# Altium project T0017_HPC_UFL_DEBUG_BOARD.PrjPcb (part 2 of 2)
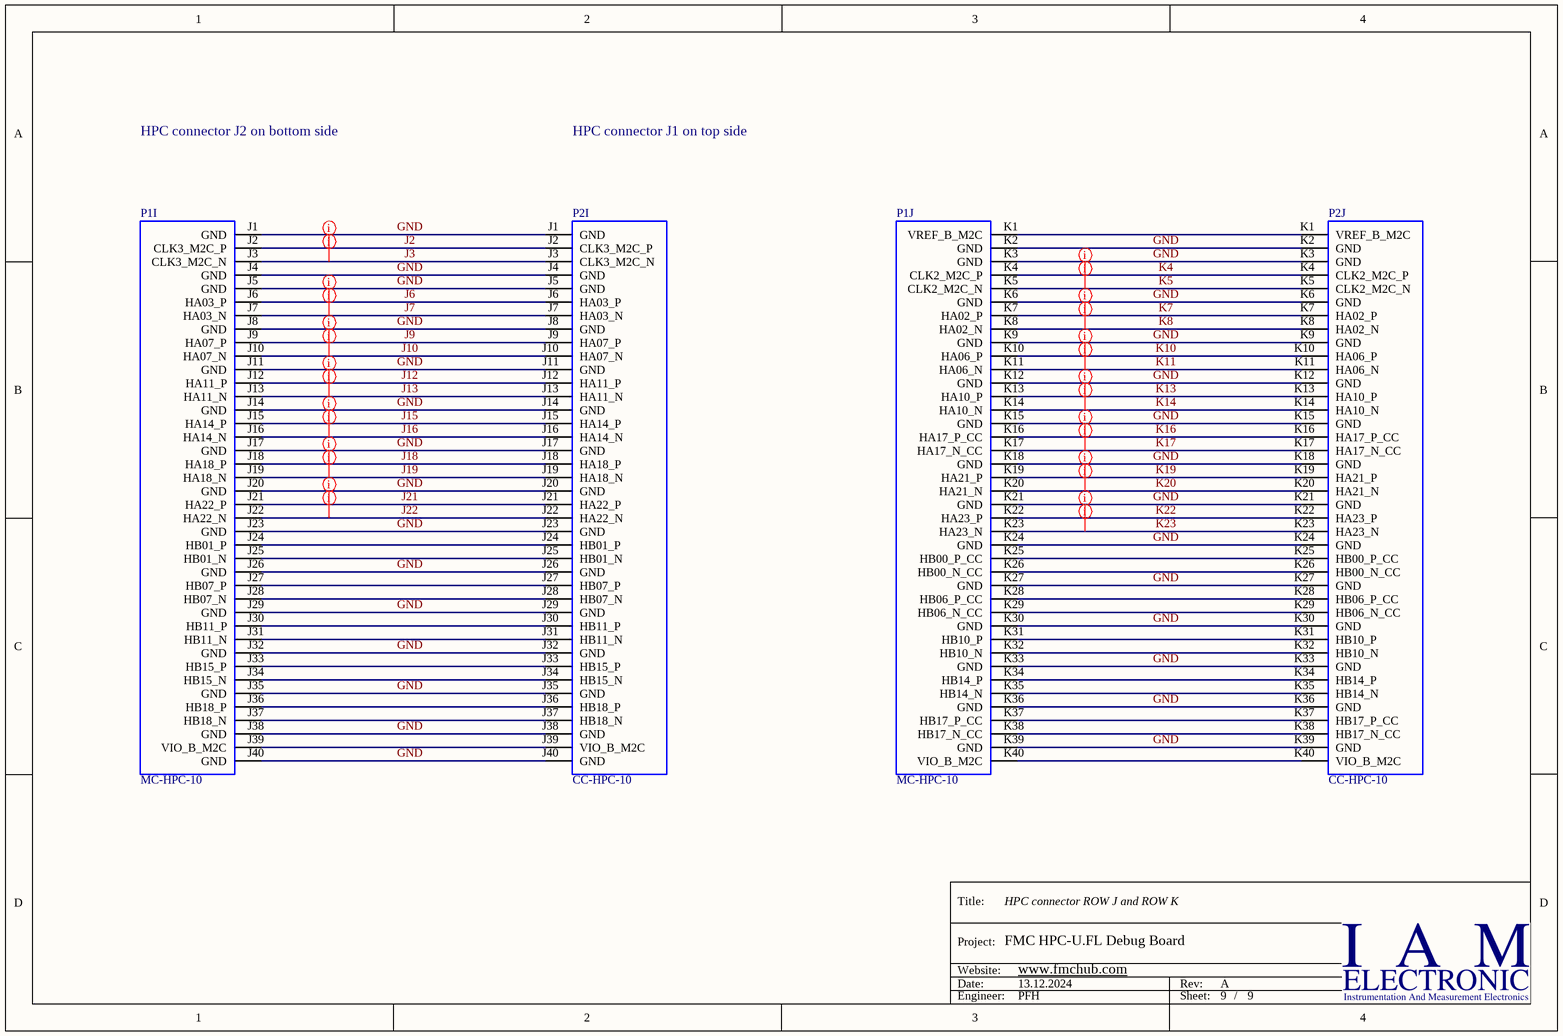
[diagram p9: FMC_HPC_UFL_DEBUG_HPC_JK.SchDoc]

## Nets that join several sheets
GND: FMC_HPC_UFL_DEBUG_TOP (MH1.0 MH2.0), FMC_HPC_UFL_DEBUG_J1_J84 (168 pins), FMC_HPC_UFL_DEBUG_J85_J156 (144 pins), FMC_HPC_UFL_DEBUG_TP_SMA (48 pins), FMC_HPC_UFL_DEBUG_HPC_AB (80 pins), FMC_HPC_UFL_DEBUG_HPC_CD (68 pins), FMC_HPC_UFL_DEBUG_HPC_EF (59 pins), FMC_HPC_UFL_DEBUG_HPC_GH (56 pins), FMC_HPC_UFL_DEBUG_HPC_JK (58 pins)
3P3V: FMC_HPC_UFL_DEBUG_HPC_CD (9 pins), FMC_HPC_UFL_DEBUG_HPC_EF (TP2.1)
3P3VAUX: FMC_HPC_UFL_DEBUG_HPC_CD (P1.D32 P2.D32), FMC_HPC_UFL_DEBUG_HPC_EF (TP3.1)
12P0V: FMC_HPC_UFL_DEBUG_HPC_CD (P1.C35 P1.C37 P2.C35 P2.C37), FMC_HPC_UFL_DEBUG_HPC_EF (TP4.1)
C10: FMC_HPC_UFL_DEBUG_J1_J84 (J43.3), FMC_HPC_UFL_DEBUG_HPC_CD (P1.C10 P2.C10)
C11: FMC_HPC_UFL_DEBUG_J1_J84 (J55.3), FMC_HPC_UFL_DEBUG_HPC_CD (P1.C11 P2.C11)
C14: FMC_HPC_UFL_DEBUG_J1_J84 (J73.3), FMC_HPC_UFL_DEBUG_HPC_CD (P1.C14 P2.C14)
C15: FMC_HPC_UFL_DEBUG_J1_J84 (J61.3), FMC_HPC_UFL_DEBUG_HPC_CD (P1.C15 P2.C15)
C18: FMC_HPC_UFL_DEBUG_J1_J84 (J74.3), FMC_HPC_UFL_DEBUG_HPC_CD (P1.C18 P2.C18)
C19: FMC_HPC_UFL_DEBUG_J1_J84 (J62.3), FMC_HPC_UFL_DEBUG_HPC_CD (P1.C19 P2.C19)
C22: FMC_HPC_UFL_DEBUG_J1_J84 (J39.3), FMC_HPC_UFL_DEBUG_HPC_CD (P1.C22 P2.C22)
C23: FMC_HPC_UFL_DEBUG_J1_J84 (J51.3), FMC_HPC_UFL_DEBUG_HPC_CD (P1.C23 P2.C23)
C26: FMC_HPC_UFL_DEBUG_J1_J84 (J50.3), FMC_HPC_UFL_DEBUG_HPC_CD (P1.C26 P2.C26)
C27: FMC_HPC_UFL_DEBUG_J1_J84 (J38.3), FMC_HPC_UFL_DEBUG_HPC_CD (P1.C27 P2.C27)
CK0_M2C_N: FMC_HPC_UFL_DEBUG_J1_J84 (J23.3), FMC_HPC_UFL_DEBUG_HPC_CD (P1.D5 P2.D5)
CK0_M2C_P: FMC_HPC_UFL_DEBUG_J1_J84 (J35.3), FMC_HPC_UFL_DEBUG_HPC_CD (P1.D4 P2.D4)
CK1_M2C_N: FMC_HPC_UFL_DEBUG_J1_J84 (J72.3), FMC_HPC_UFL_DEBUG_HPC_AB (P1.B21 P2.B21)
CK1_M2C_P: FMC_HPC_UFL_DEBUG_J1_J84 (J71.3), FMC_HPC_UFL_DEBUG_HPC_AB (P1.B20 P2.B20)
D8: FMC_HPC_UFL_DEBUG_J1_J84 (J19.3), FMC_HPC_UFL_DEBUG_HPC_CD (P1.D8 P2.D8)
D9: FMC_HPC_UFL_DEBUG_J1_J84 (J31.3), FMC_HPC_UFL_DEBUG_HPC_CD (P1.D9 P2.D9)
D11: FMC_HPC_UFL_DEBUG_J1_J84 (J67.3), FMC_HPC_UFL_DEBUG_HPC_CD (P1.D11 P2.D11)
D12: FMC_HPC_UFL_DEBUG_J1_J84 (J79.3), FMC_HPC_UFL_DEBUG_HPC_CD (P1.D12 P2.D12)
D14: FMC_HPC_UFL_DEBUG_J1_J84 (J49.3), FMC_HPC_UFL_DEBUG_HPC_CD (P1.D14 P2.D14)
D15: FMC_HPC_UFL_DEBUG_J1_J84 (J37.3), FMC_HPC_UFL_DEBUG_HPC_CD (P1.D15 P2.D15)
D17: FMC_HPC_UFL_DEBUG_J1_J84 (J25.3), FMC_HPC_UFL_DEBUG_HPC_CD (P1.D17 P2.D17)
D18: FMC_HPC_UFL_DEBUG_J1_J84 (J13.3), FMC_HPC_UFL_DEBUG_HPC_CD (P1.D18 P2.D18)
D20: FMC_HPC_UFL_DEBUG_J1_J84 (J15.3), FMC_HPC_UFL_DEBUG_HPC_CD (P1.D20 P2.D20)
D21: FMC_HPC_UFL_DEBUG_J1_J84 (J27.3), FMC_HPC_UFL_DEBUG_HPC_CD (P1.D21 P2.D21)
D23: FMC_HPC_UFL_DEBUG_J1_J84 (J63.3), FMC_HPC_UFL_DEBUG_HPC_CD (P1.D23 P2.D23)
D24: FMC_HPC_UFL_DEBUG_J1_J84 (J75.3), FMC_HPC_UFL_DEBUG_HPC_CD (P1.D24 P2.D24)
D26: FMC_HPC_UFL_DEBUG_J1_J84 (J14.3), FMC_HPC_UFL_DEBUG_HPC_CD (P1.D26 P2.D26)
D27: FMC_HPC_UFL_DEBUG_J1_J84 (J26.3), FMC_HPC_UFL_DEBUG_HPC_CD (P1.D27 P2.D27)
DP0_C2M_N: FMC_HPC_UFL_DEBUG_J1_J84 (J24.3), FMC_HPC_UFL_DEBUG_HPC_CD (P1.C3 P2.C3)
DP0_C2M_P: FMC_HPC_UFL_DEBUG_J1_J84 (J36.3), FMC_HPC_UFL_DEBUG_HPC_CD (P1.C2 P2.C2)
DP0_M2C_N: FMC_HPC_UFL_DEBUG_J1_J84 (J34.3), FMC_HPC_UFL_DEBUG_HPC_CD (P1.C7 P2.C7)
DP0_M2C_P: FMC_HPC_UFL_DEBUG_J1_J84 (J22.3), FMC_HPC_UFL_DEBUG_HPC_CD (P1.C6 P2.C6)
DP1_C2M_N: FMC_HPC_UFL_DEBUG_J1_J84 (J84.3), FMC_HPC_UFL_DEBUG_HPC_AB (P1.A23 P2.A23)
DP1_C2M_P: FMC_HPC_UFL_DEBUG_J1_J84 (J83.3), FMC_HPC_UFL_DEBUG_HPC_AB (P1.A22 P2.A22)
DP1_M2C_N: FMC_HPC_UFL_DEBUG_J1_J84 (J70.3), FMC_HPC_UFL_DEBUG_HPC_AB (P1.A3 P2.A3)
DP1_M2C_P: FMC_HPC_UFL_DEBUG_J1_J84 (J69.3), FMC_HPC_UFL_DEBUG_HPC_AB (P1.A2 P2.A2)
DP2_C2M_N: FMC_HPC_UFL_DEBUG_J1_J84 (J2.3), FMC_HPC_UFL_DEBUG_HPC_AB (P1.A27 P2.A27)
DP2_C2M_P: FMC_HPC_UFL_DEBUG_J1_J84 (J1.3), FMC_HPC_UFL_DEBUG_HPC_AB (P1.A26 P2.A26)
DP2_M2C_N: FMC_HPC_UFL_DEBUG_J1_J84 (J82.3), FMC_HPC_UFL_DEBUG_HPC_AB (P1.A7 P2.A7)
DP2_M2C_P: FMC_HPC_UFL_DEBUG_J1_J84 (J81.3), FMC_HPC_UFL_DEBUG_HPC_AB (P1.A6 P2.A6)
DP3_C2M_N: FMC_HPC_UFL_DEBUG_J1_J84 (J4.3), FMC_HPC_UFL_DEBUG_HPC_AB (P1.A31 P2.A31)
DP3_C2M_P: FMC_HPC_UFL_DEBUG_J1_J84 (J3.3), FMC_HPC_UFL_DEBUG_HPC_AB (P1.A30 P2.A30)
DP3_M2C_N: FMC_HPC_UFL_DEBUG_J1_J84 (J46.3), FMC_HPC_UFL_DEBUG_HPC_AB (P1.A11 P2.A11)
DP3_M2C_P: FMC_HPC_UFL_DEBUG_J1_J84 (J45.3), FMC_HPC_UFL_DEBUG_HPC_AB (P1.A10 P2.A10)
DP4_C2M_N: FMC_HPC_UFL_DEBUG_J1_J84 (J6.3), FMC_HPC_UFL_DEBUG_HPC_AB (P1.A35 P2.A35)
DP4_C2M_P: FMC_HPC_UFL_DEBUG_J1_J84 (J5.3), FMC_HPC_UFL_DEBUG_HPC_AB (P1.A34 P2.A34)
DP4_M2C_N: FMC_HPC_UFL_DEBUG_J1_J84 (J58.3), FMC_HPC_UFL_DEBUG_HPC_AB (P1.A15 P2.A15)
DP4_M2C_P: FMC_HPC_UFL_DEBUG_J1_J84 (J57.3), FMC_HPC_UFL_DEBUG_HPC_AB (P1.A14 P2.A14)
DP5_C2M_N: FMC_HPC_UFL_DEBUG_J1_J84 (J10.3), FMC_HPC_UFL_DEBUG_HPC_AB (P1.A39 P2.A39)
DP5_C2M_P: FMC_HPC_UFL_DEBUG_J1_J84 (J9.3), FMC_HPC_UFL_DEBUG_HPC_AB (P1.A38 P2.A38)
DP5_M2C_N: FMC_HPC_UFL_DEBUG_J1_J84 (J60.3), FMC_HPC_UFL_DEBUG_HPC_AB (P1.A19 P2.A19)
DP5_M2C_P: FMC_HPC_UFL_DEBUG_J1_J84 (J59.3), FMC_HPC_UFL_DEBUG_HPC_AB (P1.A18 P2.A18)
DP6_C2M_N: FMC_HPC_UFL_DEBUG_J1_J84 (J8.3), FMC_HPC_UFL_DEBUG_HPC_AB (P1.B37 P2.B37)
DP6_C2M_P: FMC_HPC_UFL_DEBUG_J1_J84 (J7.3), FMC_HPC_UFL_DEBUG_HPC_AB (P1.B36 P2.B36)
DP6_M2C_N: FMC_HPC_UFL_DEBUG_J1_J84 (J48.3), FMC_HPC_UFL_DEBUG_HPC_AB (P1.B17 P2.B17)
DP6_M2C_P: FMC_HPC_UFL_DEBUG_J1_J84 (J47.3), FMC_HPC_UFL_DEBUG_HPC_AB (P1.B16 P2.B16)
E2: FMC_HPC_UFL_DEBUG_J1_J84 (J56.3), FMC_HPC_UFL_DEBUG_HPC_EF (P1.E2 P2.E2)
E3: FMC_HPC_UFL_DEBUG_J1_J84 (J44.3), FMC_HPC_UFL_DEBUG_HPC_EF (P1.E3 P2.E3)
E6: FMC_HPC_UFL_DEBUG_J1_J84 (J33.3), FMC_HPC_UFL_DEBUG_HPC_EF (P1.E6 P2.E6)
E7: FMC_HPC_UFL_DEBUG_J1_J84 (J21.3), FMC_HPC_UFL_DEBUG_HPC_EF (P1.E7 P2.E7)
E9: FMC_HPC_UFL_DEBUG_J1_J84 (J54.3), FMC_HPC_UFL_DEBUG_HPC_EF (P1.E9 P2.E9)
E10: FMC_HPC_UFL_DEBUG_J1_J84 (J42.3), FMC_HPC_UFL_DEBUG_HPC_EF (P1.E10 P2.E10)
E12: FMC_HPC_UFL_DEBUG_J1_J84 (J77.3), FMC_HPC_UFL_DEBUG_HPC_EF (P1.E12 P2.E12)
E13: FMC_HPC_UFL_DEBUG_J1_J84 (J65.3), FMC_HPC_UFL_DEBUG_HPC_EF (P1.E13 P2.E13)
E15: FMC_HPC_UFL_DEBUG_J1_J84 (J29.3), FMC_HPC_UFL_DEBUG_HPC_EF (P1.E15 P2.E15)
E16: FMC_HPC_UFL_DEBUG_J1_J84 (J17.3), FMC_HPC_UFL_DEBUG_HPC_EF (P1.E16 P2.E16)
E18: FMC_HPC_UFL_DEBUG_J1_J84 (J40.3), FMC_HPC_UFL_DEBUG_HPC_EF (P1.E18 P2.E18)
E19: FMC_HPC_UFL_DEBUG_J1_J84 (J52.3), FMC_HPC_UFL_DEBUG_HPC_EF (P1.E19 P2.E19)
F4: FMC_HPC_UFL_DEBUG_J1_J84 (J32.3), FMC_HPC_UFL_DEBUG_HPC_EF (P1.F4 P2.F4)
F5: FMC_HPC_UFL_DEBUG_J1_J84 (J20.3), FMC_HPC_UFL_DEBUG_HPC_EF (P1.F5 P2.F5)
F7: FMC_HPC_UFL_DEBUG_J1_J84 (J78.3), FMC_HPC_UFL_DEBUG_HPC_EF (P1.F7 P2.F7)
F8: FMC_HPC_UFL_DEBUG_J1_J84 (J66.3), FMC_HPC_UFL_DEBUG_HPC_EF (P1.F8 P2.F8)
F10: FMC_HPC_UFL_DEBUG_J1_J84 (J30.3), FMC_HPC_UFL_DEBUG_HPC_EF (P1.F10 P2.F10)
F11: FMC_HPC_UFL_DEBUG_J1_J84 (J18.3), FMC_HPC_UFL_DEBUG_HPC_EF (P1.F11 P2.F11)
F13: FMC_HPC_UFL_DEBUG_J1_J84 (J53.3), FMC_HPC_UFL_DEBUG_HPC_EF (P1.F13 P2.F13)
F14: FMC_HPC_UFL_DEBUG_J1_J84 (J41.3), FMC_HPC_UFL_DEBUG_HPC_EF (P1.F14 P2.F14)
F16: FMC_HPC_UFL_DEBUG_J1_J84 (J28.3), FMC_HPC_UFL_DEBUG_HPC_EF (P1.F16 P2.F16)
F17: FMC_HPC_UFL_DEBUG_J1_J84 (J16.3), FMC_HPC_UFL_DEBUG_HPC_EF (P1.F17 P2.F17)
F19: FMC_HPC_UFL_DEBUG_J1_J84 (J64.3), FMC_HPC_UFL_DEBUG_HPC_EF (P1.F19 P2.F19)
F20: FMC_HPC_UFL_DEBUG_J1_J84 (J76.3), FMC_HPC_UFL_DEBUG_HPC_EF (P1.F20 P2.F20)
G2: FMC_HPC_UFL_DEBUG_J1_J84 (J80.3), FMC_HPC_UFL_DEBUG_HPC_GH (P1.G2 P2.G2)
G3: FMC_HPC_UFL_DEBUG_J1_J84 (J68.3), FMC_HPC_UFL_DEBUG_HPC_GH (P1.G3 P2.G3)
G6: FMC_HPC_UFL_DEBUG_J85_J156 (J95.3), FMC_HPC_UFL_DEBUG_HPC_GH (P1.G6 P2.G6)
G7: FMC_HPC_UFL_DEBUG_J85_J156 (J107.3), FMC_HPC_UFL_DEBUG_HPC_GH (P1.G7 P2.G7)
G9: FMC_HPC_UFL_DEBUG_J85_J156 (J94.3), FMC_HPC_UFL_DEBUG_HPC_GH (P1.G9 P2.G9)
G10: FMC_HPC_UFL_DEBUG_J85_J156 (J106.3), FMC_HPC_UFL_DEBUG_HPC_GH (P1.G10 P2.G10)
G12: FMC_HPC_UFL_DEBUG_J85_J156 (J93.3), FMC_HPC_UFL_DEBUG_HPC_GH (P1.G12 P2.G12)
G13: FMC_HPC_UFL_DEBUG_J85_J156 (J105.3), FMC_HPC_UFL_DEBUG_HPC_GH (P1.G13 P2.G13)
G15: FMC_HPC_UFL_DEBUG_J85_J156 (J92.3), FMC_HPC_UFL_DEBUG_HPC_GH (P1.G15 P2.G15)
G16: FMC_HPC_UFL_DEBUG_J85_J156 (J104.3), FMC_HPC_UFL_DEBUG_HPC_GH (P1.G16 P2.G16)
G18: FMC_HPC_UFL_DEBUG_J85_J156 (J103.3), FMC_HPC_UFL_DEBUG_HPC_GH (P1.G18 P2.G18)
G19: FMC_HPC_UFL_DEBUG_J85_J156 (J91.3), FMC_HPC_UFL_DEBUG_HPC_GH (P1.G19 P2.G19)
G21: FMC_HPC_UFL_DEBUG_J85_J156 (J102.3), FMC_HPC_UFL_DEBUG_HPC_GH (P1.G21 P2.G21)
G22: FMC_HPC_UFL_DEBUG_J85_J156 (J90.3), FMC_HPC_UFL_DEBUG_HPC_GH (P1.G22 P2.G22)
G24: FMC_HPC_UFL_DEBUG_J85_J156 (J101.3), FMC_HPC_UFL_DEBUG_HPC_GH (P1.G24 P2.G24)
G25: FMC_HPC_UFL_DEBUG_J85_J156 (J89.3), FMC_HPC_UFL_DEBUG_HPC_GH (P1.G25 P2.G25)
G27: FMC_HPC_UFL_DEBUG_J85_J156 (J100.3), FMC_HPC_UFL_DEBUG_HPC_GH (P1.G27 P2.G27)
G28: FMC_HPC_UFL_DEBUG_J85_J156 (J88.3), FMC_HPC_UFL_DEBUG_HPC_GH (P1.G28 P2.G28)
G30: FMC_HPC_UFL_DEBUG_J85_J156 (J99.3), FMC_HPC_UFL_DEBUG_HPC_GH (P1.G30 P2.G30)
G31: FMC_HPC_UFL_DEBUG_J85_J156 (J87.3), FMC_HPC_UFL_DEBUG_HPC_GH (P1.G31 P2.G31)
G33: FMC_HPC_UFL_DEBUG_J85_J156 (J98.3), FMC_HPC_UFL_DEBUG_HPC_GH (P1.G33 P2.G33)
G34: FMC_HPC_UFL_DEBUG_J85_J156 (J86.3), FMC_HPC_UFL_DEBUG_HPC_GH (P1.G34 P2.G34)
G36: FMC_HPC_UFL_DEBUG_J85_J156 (J97.3), FMC_HPC_UFL_DEBUG_HPC_GH (P1.G36 P2.G36)
G37: FMC_HPC_UFL_DEBUG_J85_J156 (J85.3), FMC_HPC_UFL_DEBUG_HPC_GH (P1.G37 P2.G37)
H4: FMC_HPC_UFL_DEBUG_J85_J156 (J96.3), FMC_HPC_UFL_DEBUG_HPC_GH (P1.H4 P2.H4)
H5: FMC_HPC_UFL_DEBUG_J85_J156 (J108.3), FMC_HPC_UFL_DEBUG_HPC_GH (P1.H5 P2.H5)
H7: FMC_HPC_UFL_DEBUG_J85_J156 (J119.3), FMC_HPC_UFL_DEBUG_HPC_GH (P1.H7 P2.H7)
H8: FMC_HPC_UFL_DEBUG_J85_J156 (J131.3), FMC_HPC_UFL_DEBUG_HPC_GH (P1.H8 P2.H8)
H10: FMC_HPC_UFL_DEBUG_J85_J156 (J118.3), FMC_HPC_UFL_DEBUG_HPC_GH (P1.H10 P2.H10)
H11: FMC_HPC_UFL_DEBUG_J85_J156 (J130.3), FMC_HPC_UFL_DEBUG_HPC_GH (P1.H11 P2.H11)
H13: FMC_HPC_UFL_DEBUG_J85_J156 (J117.3), FMC_HPC_UFL_DEBUG_HPC_GH (P1.H13 P2.H13)
H14: FMC_HPC_UFL_DEBUG_J85_J156 (J129.3), FMC_HPC_UFL_DEBUG_HPC_GH (P1.H14 P2.H14)
H16: FMC_HPC_UFL_DEBUG_J85_J156 (J116.3), FMC_HPC_UFL_DEBUG_HPC_GH (P1.H16 P2.H16)
H17: FMC_HPC_UFL_DEBUG_J85_J156 (J128.3), FMC_HPC_UFL_DEBUG_HPC_GH (P1.H17 P2.H17)
H19: FMC_HPC_UFL_DEBUG_J85_J156 (J115.3), FMC_HPC_UFL_DEBUG_HPC_GH (P1.H19 P2.H19)
H20: FMC_HPC_UFL_DEBUG_J85_J156 (J127.3), FMC_HPC_UFL_DEBUG_HPC_GH (P1.H20 P2.H20)
H22: FMC_HPC_UFL_DEBUG_J85_J156 (J114.3), FMC_HPC_UFL_DEBUG_HPC_GH (P1.H22 P2.H22)
H23: FMC_HPC_UFL_DEBUG_J85_J156 (J126.3), FMC_HPC_UFL_DEBUG_HPC_GH (P1.H23 P2.H23)
H25: FMC_HPC_UFL_DEBUG_J85_J156 (J113.3), FMC_HPC_UFL_DEBUG_HPC_GH (P1.H25 P2.H25)
H26: FMC_HPC_UFL_DEBUG_J85_J156 (J125.3), FMC_HPC_UFL_DEBUG_HPC_GH (P1.H26 P2.H26)
H28: FMC_HPC_UFL_DEBUG_J85_J156 (J112.3), FMC_HPC_UFL_DEBUG_HPC_GH (P1.H28 P2.H28)
H29: FMC_HPC_UFL_DEBUG_J85_J156 (J124.3), FMC_HPC_UFL_DEBUG_HPC_GH (P1.H29 P2.H29)
H31: FMC_HPC_UFL_DEBUG_J85_J156 (J111.3), FMC_HPC_UFL_DEBUG_HPC_GH (P1.H31 P2.H31)
H32: FMC_HPC_UFL_DEBUG_J85_J156 (J123.3), FMC_HPC_UFL_DEBUG_HPC_GH (P1.H32 P2.H32)
H34: FMC_HPC_UFL_DEBUG_J85_J156 (J110.3), FMC_HPC_UFL_DEBUG_HPC_GH (P1.H34 P2.H34)
H35: FMC_HPC_UFL_DEBUG_J85_J156 (J122.3), FMC_HPC_UFL_DEBUG_HPC_GH (P1.H35 P2.H35)
H37: FMC_HPC_UFL_DEBUG_J85_J156 (J109.3), FMC_HPC_UFL_DEBUG_HPC_GH (P1.H37 P2.H37)
H38: FMC_HPC_UFL_DEBUG_J85_J156 (J121.3), FMC_HPC_UFL_DEBUG_HPC_GH (P1.H38 P2.H38)
J2: FMC_HPC_UFL_DEBUG_J85_J156 (J120.3), FMC_HPC_UFL_DEBUG_HPC_JK (P1.J2 P2.J2)
J3: FMC_HPC_UFL_DEBUG_J85_J156 (J132.3), FMC_HPC_UFL_DEBUG_HPC_JK (P1.J3 P2.J3)
J6: FMC_HPC_UFL_DEBUG_J85_J156 (J143.3), FMC_HPC_UFL_DEBUG_HPC_JK (P1.J6 P2.J6)
J7: FMC_HPC_UFL_DEBUG_J85_J156 (J142.3), FMC_HPC_UFL_DEBUG_HPC_JK (P1.J7 P2.J7)
J9: FMC_HPC_UFL_DEBUG_J85_J156 (J141.3), FMC_HPC_UFL_DEBUG_HPC_JK (P1.J9 P2.J9)
J10: FMC_HPC_UFL_DEBUG_J85_J156 (J153.3), FMC_HPC_UFL_DEBUG_HPC_JK (P1.J10 P2.J10)
J12: FMC_HPC_UFL_DEBUG_J85_J156 (J139.3), FMC_HPC_UFL_DEBUG_HPC_JK (P1.J12 P2.J12)
J13: FMC_HPC_UFL_DEBUG_J85_J156 (J151.3), FMC_HPC_UFL_DEBUG_HPC_JK (P1.J13 P2.J13)
J15: FMC_HPC_UFL_DEBUG_J85_J156 (J137.3), FMC_HPC_UFL_DEBUG_HPC_JK (P1.J15 P2.J15)
J16: FMC_HPC_UFL_DEBUG_J85_J156 (J149.3), FMC_HPC_UFL_DEBUG_HPC_JK (P1.J16 P2.J16)
J18: FMC_HPC_UFL_DEBUG_J85_J156 (J135.3), FMC_HPC_UFL_DEBUG_HPC_JK (P1.J18 P2.J18)
J19: FMC_HPC_UFL_DEBUG_J85_J156 (J147.3), FMC_HPC_UFL_DEBUG_HPC_JK (P1.J19 P2.J19)
J21: FMC_HPC_UFL_DEBUG_J85_J156 (J133.3), FMC_HPC_UFL_DEBUG_HPC_JK (P1.J21 P2.J21)
J22: FMC_HPC_UFL_DEBUG_J85_J156 (J145.3), FMC_HPC_UFL_DEBUG_HPC_JK (P1.J22 P2.J22)
K4: FMC_HPC_UFL_DEBUG_J85_J156 (J144.3), FMC_HPC_UFL_DEBUG_HPC_JK (P1.K4 P2.K4)
K5: FMC_HPC_UFL_DEBUG_J85_J156 (J156.3), FMC_HPC_UFL_DEBUG_HPC_JK (P1.K5 P2.K5)
K7: FMC_HPC_UFL_DEBUG_J85_J156 (J155.3), FMC_HPC_UFL_DEBUG_HPC_JK (P1.K7 P2.K7)
K8: FMC_HPC_UFL_DEBUG_J85_J156 (J154.3), FMC_HPC_UFL_DEBUG_HPC_JK (P1.K8 P2.K8)
K10: FMC_HPC_UFL_DEBUG_J85_J156 (J140.3), FMC_HPC_UFL_DEBUG_HPC_JK (P1.K10 P2.K10)
K11: FMC_HPC_UFL_DEBUG_J85_J156 (J152.3), FMC_HPC_UFL_DEBUG_HPC_JK (P1.K11 P2.K11)
K13: FMC_HPC_UFL_DEBUG_J85_J156 (J138.3), FMC_HPC_UFL_DEBUG_HPC_JK (P1.K13 P2.K13)
K14: FMC_HPC_UFL_DEBUG_J85_J156 (J150.3), FMC_HPC_UFL_DEBUG_HPC_JK (P1.K14 P2.K14)
K16: FMC_HPC_UFL_DEBUG_J85_J156 (J136.3), FMC_HPC_UFL_DEBUG_HPC_JK (P1.K16 P2.K16)
K17: FMC_HPC_UFL_DEBUG_J85_J156 (J148.3), FMC_HPC_UFL_DEBUG_HPC_JK (P1.K17 P2.K17)
K19: FMC_HPC_UFL_DEBUG_J85_J156 (J134.3), FMC_HPC_UFL_DEBUG_HPC_JK (P1.K19 P2.K19)
K20: FMC_HPC_UFL_DEBUG_J85_J156 (J146.3), FMC_HPC_UFL_DEBUG_HPC_JK (P1.K20 P2.K20)
K22: FMC_HPC_UFL_DEBUG_J1_J84 (J12.3), FMC_HPC_UFL_DEBUG_HPC_JK (P1.K22 P2.K22)
K23: FMC_HPC_UFL_DEBUG_J1_J84 (J11.3), FMC_HPC_UFL_DEBUG_HPC_JK (P1.K23 P2.K23)
PRS#: FMC_HPC_UFL_DEBUG_HPC_EF (TP5.1), FMC_HPC_UFL_DEBUG_HPC_GH (P1.H2 P2.H2)
VADJ: FMC_HPC_UFL_DEBUG_HPC_EF (5 pins), FMC_HPC_UFL_DEBUG_HPC_GH (P1.G39 P1.H40 P2.G39 P2.H40)